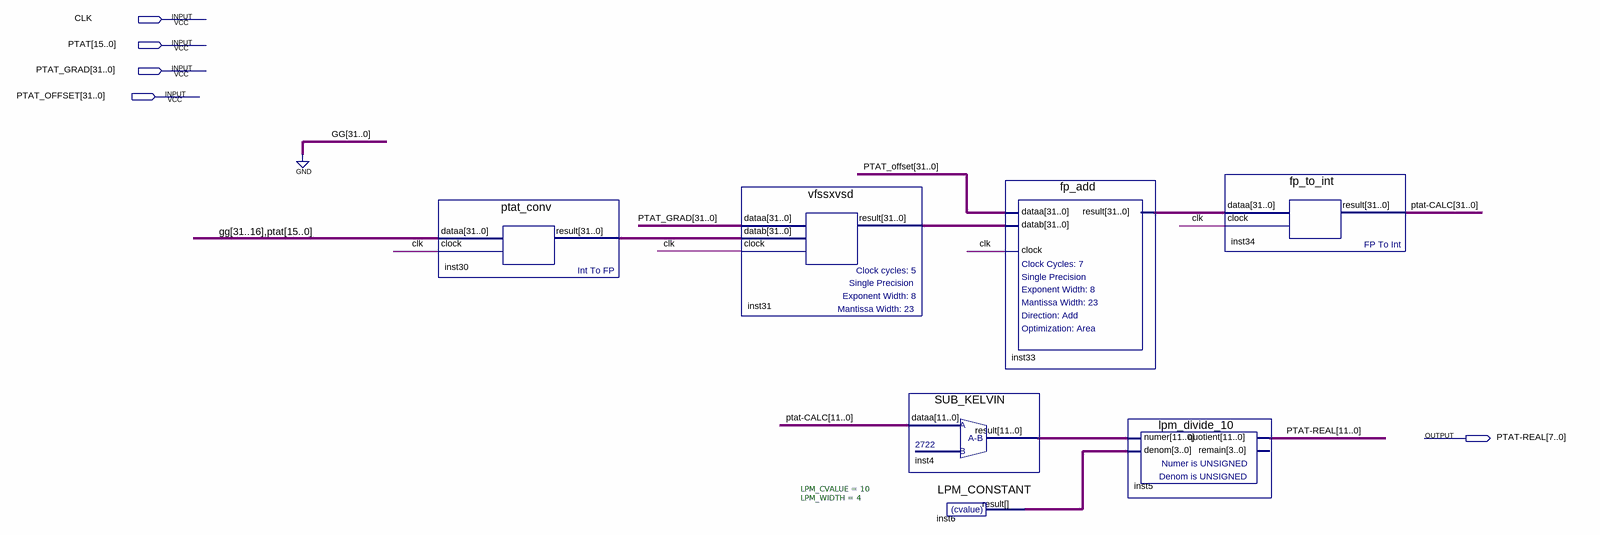
[diagram p0: schematic sheet]
// Quartus schematic PTAT_CALC.bdf as structural Verilog: 7 symbols, 5 pins
module PTAT_CALC (
  input  CLK,
  input  [15:0] PTAT,
  input  [31:0] PTAT_GRAD,
  input  [31:0] PTAT_OFFSET,
  output [11:0] \PTAT-REAL 
);

  wire [3:0] inst6_result;
  wire [11:0] inst4_result;
  wire [31:0] inst30_result, inst31_result, inst33_result, \ptat-CALC ;

  ptat_conv inst30 (.dataa({{16{1'b0}}, PTAT}), .clock(CLK), .result(inst30_result));
  vfssxvsd inst31 (.dataa(PTAT_GRAD), .datab(inst30_result), .clock(CLK), .result(inst31_result));
  SUB_KELVIN inst4 (.dataa(\ptat-CALC [11:0]), .result(inst4_result));
  LPM_CONSTANT #(.LPM_CVALUE(10), .LPM_WIDTH(4)) inst6 (.result(inst6_result));
  fp_add inst33 (.dataa(PTAT_OFFSET), .datab(inst31_result), .clock(CLK), .result(inst33_result));
  lpm_divide_10 inst5 (.numer(inst4_result), .denom(inst6_result), .quotient(\PTAT-REAL ));  // open: remain
  fp_to_int inst34 (.dataa(inst33_result), .clock(CLK), .result(\ptat-CALC ));
endmodule
